# Altium project COMM_BOARD_V1.PrjPcb (part 2 of 2)

## Sheet I2C.SchDoc
size 420 x 297 mm; SheetNumber: 2; SheetTotal: 2
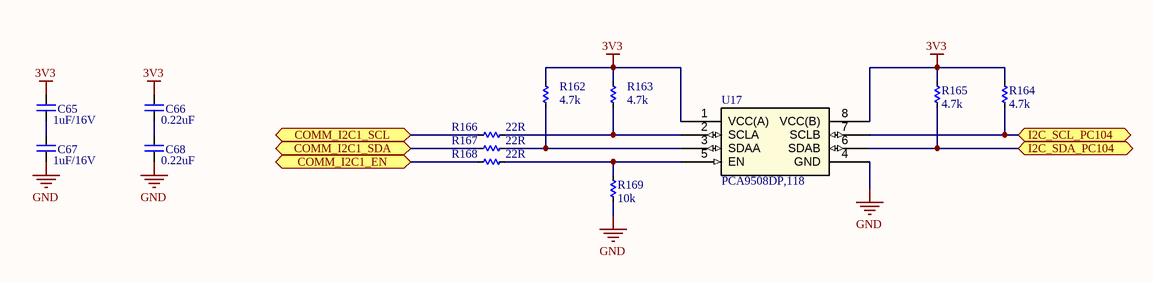
[diagram p12: I2C.SchDoc]

### Parts
C65  1uF/16V  [CAP_C_1608X80]
C66  0.22uF  [CAP_C_1608X80]
C67  1uF/16V  [CAP_C_1608X80]
C68  0.22uF  [CAP_C_1608X80]
R162  4.7k  [RES_C_1608X60]
R163  4.7k  [RES_C_1608X60]
R164  4.7k  [RES_C_1608X60]
R165  4.7k  [RES_C_1608X60]
R166  22R  [RES_C_1608X60]
R167  22R  [RES_C_1608X60]
R168  22R  [RES_C_1608X60]
R169  10k  [RES_C_1608X60]
U17  PCA9508DP,118  [TSSOP8_SOT505-1_NXP]

### Ports
COMM_I2C1_EN (bidir), COMM_I2C1_SCL (bidir), COMM_I2C1_SDA (bidir), I2C_SCL_PC104 (bidir), I2C_SDA_PC104 (bidir)

### Nets
3V3: C65.2 C66.2 R162.1 R163.1 R164.1 R165.1 U17.1(VCC(A)) U17.8(VCC(B))
GND: C67.1 C68.1 R169.2 U17.4(GND)
COMM_I2C4_EN: R168.2 ; port COMM_I2C1_EN
COMM_I2C4_SCL: R166.2 ; port COMM_I2C1_SCL
COMM_I2C4_SDA: R167.2 ; port COMM_I2C1_SDA
NetC65_1: C65.1 C67.2
NetC66_1: C66.1 C68.2
NetJ9_5: R164.2 U17.7(SCLB) ; port I2C_SCL_PC104
NetJ9_6: R165.2 U17.6(SDAB) ; port I2C_SDA_PC104
NetR162_2: R162.2 R167.1 U17.3(SDAA)
NetR163_2: R163.2 R166.1 U17.2(SCLA)
NetR168_1: R168.1 R169.1 U17.5(EN)

### Notes on the sheet
- Sub-system:
- Design by:
- Sheet title:
- Project:
- Sheet:
- of
- Checked by:
- Approved by:
- Doc no:
- Revision:
- Size:
- Date:

### Library data of the parts
C65-C68 = CAP_SMD: CAP_Chip; Value: 33pF
R162-R169 = _RES_B_2: RES
U17 = PCA9508DP,118: No Description Available; Manufacturer_Name: NXP; Copyright: Copyright (C) 2025 Ultra Librarian. All rights reserved.; Manufacturer_Part_Number: PCA9508DP,118; RefDes: RefDes; Type: Type

## Sheet CONNECTOR.SchDoc
size 420 x 297 mm; SheetNumber: 5; SheetTotal: 5
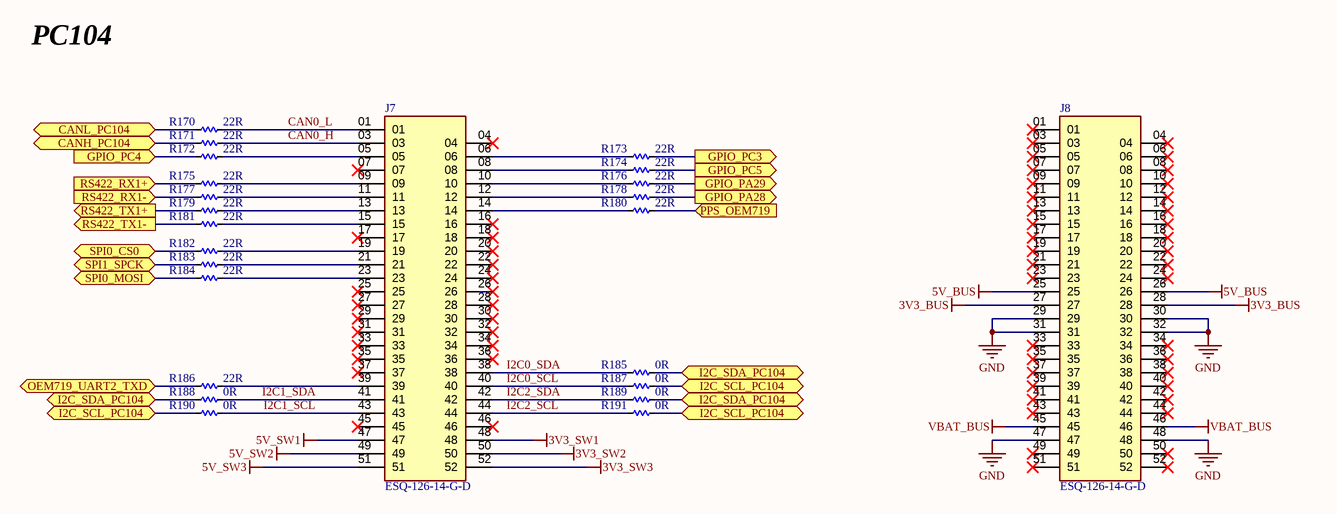
[diagram p13: CONNECTOR.SchDoc]

### Parts
J7  ESQ-126-14-G-D  [ESQ-126-14-G-D]
J8  ESQ-126-14-G-D  [ESQ-126-14-G-D]
R170  22R  [RES_C_1608X60]
R171  22R  [RES_C_1608X60]
R172  22R  [RES_C_1608X60]
R173  22R  [RES_C_1608X60]
R174  22R  [RES_C_1608X60]
R175  22R  [RES_C_1608X60]
R176  22R  [RES_C_1608X60]
R177  22R  [RES_C_1608X60]
R178  22R  [RES_C_1608X60]
R179  22R  [RES_C_1608X60]
R180  22R  [RES_C_1608X60]
R181  22R  [RES_C_1608X60]
R182  22R  [RES_C_1608X60]
R183  22R  [RES_C_1608X60]
R184  22R  [RES_C_1608X60]
R185  0R  [RES_C_1608X60]
R186  22R  [RES_C_1608X60]
R187  0R  [RES_C_1608X60]
R188  0R  [RES_C_1608X60]
R189  0R  [RES_C_1608X60]
R190  0R  [RES_C_1608X60]
R191  0R  [RES_C_1608X60]

### Ports
CANH_PC104 (bidir), CANL_PC104 (bidir), GPIO_PA28 (out), GPIO_PA29 (out), GPIO_PC3 (out), GPIO_PC4 (in), GPIO_PC5 (out), I2C_SCL_PC104 (bidir), I2C_SDA_PC104 (bidir), OEM719_UART2_TXD (bidir), PPS_OEM719 (in), RS422_RX1+ (in), RS422_RX1- (in), RS422_TX1+ (out), RS422_TX1- (out), SPI0_CS0 (bidir), SPI0_MOSI (bidir), SPI1_SPCK (bidir)

### Nets
3V3_BUS: J8.27 J8.28
3V3_SW1: J7.48
3V3_SW2: J7.50
3V3_SW3: J7.52
5V_BUS: J8.25 J8.26
5V_SW1: J7.47
5V_SW2: J7.49
5V_SW3: J7.51
GND: J8.29 J8.30 J8.31 J8.32 J8.47 J8.48
VBAT_BUS: J8.45 J8.46
CAN0_H: J7.03 R171.2
CAN0_L: J7.01 R170.2
I2C0_SCL: J7.40 R187.1
I2C0_SDA: J7.38 R185.1
I2C1_SCL: J7.43 R190.2
I2C1_SDA: J7.41 R188.2
I2C2_SCL: J7.44 R191.1
I2C2_SDA: J7.42 R189.1
NetCR1_1: R171.1 ; port CANH_PC104
NetCR1_2: R170.1 ; port CANL_PC104
NetJ7_05: J7.05 R172.2
NetJ7_06: J7.06 R173.1
NetJ7_08: J7.08 R174.1
NetJ7_09: J7.09 R175.2
NetJ7_10: J7.10 R176.1
NetJ7_11: J7.11 R177.2
NetJ7_12: J7.12 R178.1
NetJ7_13: J7.13 R179.2
NetJ7_14: J7.14 R180.1
NetJ7_15: J7.15 R181.2
NetJ7_19: J7.19 R182.2
NetJ7_21: J7.21 R183.2
NetJ7_23: J7.23 R184.2
NetJ7_39: J7.39 R186.2
NetJ9_5: R187.2 R190.1 R191.2 ; port I2C_SCL_PC104
NetJ9_6: R185.2 R188.1 R189.2 ; port I2C_SDA_PC104
NetR172_1: R172.1 ; port GPIO_PC4
NetR173_2: R173.2 ; port GPIO_PC3
NetR174_2: R174.2 ; port GPIO_PC5
NetR175_1: R175.1 ; port RS422_RX1+
NetR176_2: R176.2 ; port GPIO_PA29
NetR177_1: R177.1 ; port RS422_RX1-
NetR178_2: R178.2 ; port GPIO_PA28
NetR179_1: R179.1 ; port RS422_TX1+
NetR180_2: R180.2 ; port PPS_OEM719
NetR181_1: R181.1 ; port RS422_TX1-
NetR182_1: R182.1 ; port SPI0_CS0
NetR183_1: R183.1 ; port SPI1_SPCK
NetR184_1: R184.1 ; port SPI0_MOSI
NetR186_1: R186.1 ; port OEM719_UART2_TXD

Not connected (* = marked no-connect by the designer): J7 04* 07* 16* 17* 18* 20* 22* 24* 25* 26* 27* 28* 29* 30* 31* 32* 33* 34* 35* 36* 37* 45* 46*; J8 01* 03* 04* 05* 06* 07* 08* 09* 10* 11* 12* 13* 14* 15* 16* 17* 18* 19* 20* 21* 22* 23* 24* 33* 34* 35* 36* 37* 38* 39* 40* 41* 42* 43* 44* 49* 50* 51* 52*

### Notes on the sheet
- PC104
- Sub-system:
- Design by:
- Sheet title:
- Project:
- Sheet:
- of
- Checked by:
- Approved by:
- Doc no:
- Revision:
- Size:
- Date:

### Library data of the parts
J7 J8 = ESQ-126-14-G-D: PC / 104 Connectors Elevated Socket Strip
R170-R191 = _RES_B_2: RES

## Sheet FRAM.SchDoc
size 420 x 297 mm
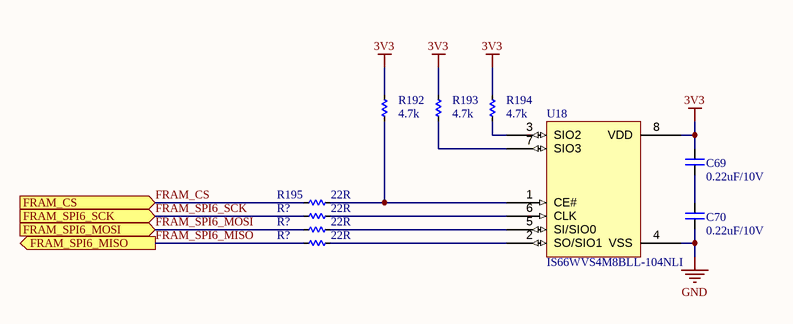
[diagram p14: FRAM.SchDoc]

### Parts
(Parts that share a designator on the sheet are numbered #1, #2 ... from top to bottom, then left to right.)
C69  0.22uF/10V  [CAP_C_1608X80]
C70  0.22uF/10V  [CAP_C_1608X80]
R192  4.7k  [RES_C_1608X60]
R193  4.7k  [RES_C_1608X60]
R194  4.7k  [RES_C_1608X60]
R195  22R  [RES_C_1608X60]
R?#77  22R  [RES_C_1608X60]
R?#78  22R  [RES_C_1608X60]
R?#79  22R  [RES_C_1608X60]
U18  IS66WVS4M8BLL-104NLI  [SOIC8_150MIL_N_ISI]

### Ports
FRAM_CS (in), FRAM_SPI6_MISO (out), FRAM_SPI6_MOSI (in), FRAM_SPI6_SCK (in)

### Nets
3V3: C69.2 R192.2 R193.2 R194.2 U18.8(VDD)
GND: C70.1 U18.4(VSS)
FRAM_CS: R195.1 ; port FRAM_CS
FRAM_SPI6_MISO: R?#79.1 ; port FRAM_SPI6_MISO
FRAM_SPI6_MOSI: R?#78.1 ; port FRAM_SPI6_MOSI
FRAM_SPI6_SCK: R?#77.1 ; port FRAM_SPI6_SCK
NetC69_1: C69.1 C70.2
NetR192_1: R192.1 R195.2 U18.1(CE#)
NetR193_1: R193.1 U18.7(SIO3)
NetR194_1: R194.1 U18.3(SIO2)
NetR?#77_2: R?#77.2 U18.6(CLK)
NetR?#78_2: R?#78.2 U18.5(SI/SIO0)
NetR?#79_2: R?#79.2 U18.2(SO/SIO1)

### Notes on the sheet
- Sub-system:
- Design by:
- Sheet title:
- Project:
- Sheet:
- of
- Checked by:
- Approved by:
- Doc no:
- Revision:
- Size:
- Date:

### Library data of the parts
C69 C70 = CAP_SMD: CAP_Chip; Value: 33pF
R192-R195 R?#77-R?#79 = _RES_B_2: RES
U18 = IS66WVS4M8BLL-104NLI: No Description Available; Manufacturer_Name: ISSI; Type: Memory; Copyright: Copyright (C) 2025 Ultra Librarian. All rights reserved.; Manufacturer_Part_Number: IS66WVS4M8BLL-104NLI; RefDes: RefDes

## Sheet CONNECT_EXP.SchDoc
size 420 x 297 mm
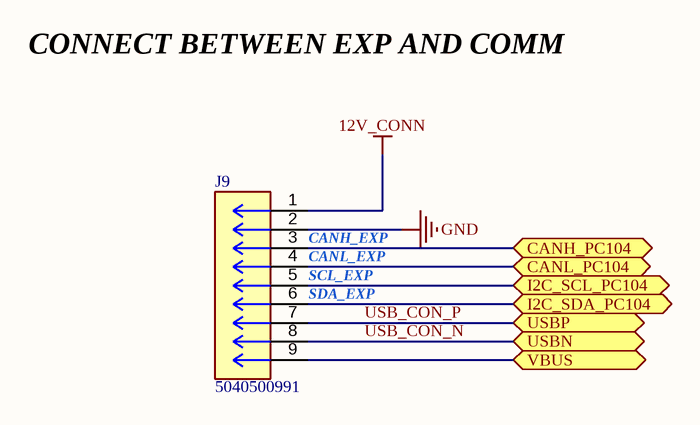
[diagram p15: CONNECT_EXP.SchDoc]

### Parts
J9  5040500991  [5040500991]

### Ports
CANH_PC104 (bidir), CANL_PC104 (bidir), I2C_SCL_PC104 (bidir), I2C_SDA_PC104 (bidir), USBN (bidir), USBP (bidir), VBUS (bidir)

### Nets
12V_CONN: J9.1
GND: J9.2
USB_CON_N: J9.8 ; port USBN
USB_CON_P: J9.7 ; port USBP
NetCR1_1: J9.3 ; port CANH_PC104
NetCR1_2: J9.4 ; port CANL_PC104
NetJ9_5: J9.5 ; port I2C_SCL_PC104
NetJ9_6: J9.6 ; port I2C_SDA_PC104
NetJ9_9: J9.9 ; port VBUS

### Notes on the sheet
- CONNECT BETWEEN EXP AND COMM
- (near J9) CANL_EXP
- (near J9) CANH_EXP
- (near J9) SCL_EXP
- (near J9) SDA_EXP
- Sub-system:
- Design by:
- Sheet title:
- Project:
- Sheet:
- of
- Checked by:
- Approved by:
- Doc no:
- Revision:
- Size:
- Date:

### Library data of the parts
J9 = 5040500991: Connector Header Surface Mount, Right Angle 9 position 0.059" (1.50mm)

## Sheet WATCHDOG.SchDoc
size 420 x 297 mm; SheetNumber: 4; SheetTotal: 4
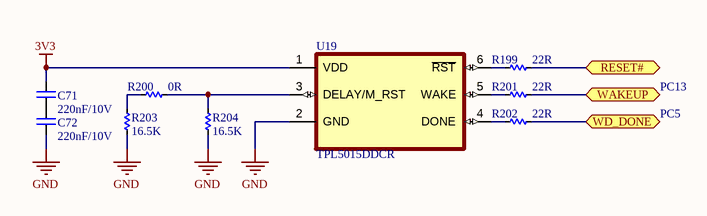
[diagram p16: WATCHDOG.SchDoc]

### Parts
C71  220nF/10V  [CAP_C_1608X80]
C72  220nF/10V  [CAP_C_1608X80]
R199  22R  [RES_C_1608X60]
R200  0R  [RES_C_1608X60]
R201  22R  [RES_C_1608X60]
R202  22R  [RES_C_1608X60]
R203  16.5K  [RES_C_1608X60]
R204  16.5K  [RES_C_1608X60]
U19  TPL5015DDCR  [TPL5010DDCR]

### Ports
RESET# (bidir), WAKEUP (bidir), WD_DONE (bidir)

### Nets
3V3: C71.2 U19.1(VDD)
GND: C72.1 R203.1 R204.1 U19.2(GND)
RESET#: R199.2 ; port RESET#
WAKEUP: R201.2 ; port WAKEUP
WD_DONE: R202.2 ; port WD_DONE
NetC71_1: C71.1 C72.2
NetR199_1: R199.1 U19.6(~{RST})
NetR200_1: R200.1 R203.2
NetR200_2: R200.2 R204.2 U19.3(DELAY/M_RST)
NetR201_1: R201.1 U19.5(WAKE)
NetR202_1: R202.1 U19.4(DONE)

### Notes on the sheet
- PC13
- PC5
- Sub-system:
- Design by:
- Sheet title:
- Project:
- Sheet:
- of
- Checked by:
- Approved by:
- Doc no:
- Revision:
- Size:
- Date:

### Library data of the parts
C71 C72 = CAP_SMD: CAP_Chip; Value: 33pF
R199-R204 = _RES_B_2: RES
U19 = TPL5015DDCR: OSC PROG TIMER TSOT23-6

## Nets that join several sheets
1V8: POWER (C61.2 U?#3.2), USB_HS_DEVICE (C33.2 U8.28 U8.30)
3V3: POWER (9 pins), MCU (5 pins), SDRAM (28 pins), MCU_POWER (6 pins), eMMC (26 pins), USB_HS_DEVICE (11 pins), LVDS (6 pins), DEBUG (J5.6 J6.1), I2C (8 pins), FRAM (5 pins), WATCHDOG (C71.2 U19.1)
12V_CONN: POWER (6 pins), CONNECT_EXP (J9.1)
GND: POWER (30 pins), MCU (11 pins), SDRAM (28 pins), MCU_POWER (78 pins), eMMC (18 pins), CAN (6 pins), USB_HS_DEVICE (18 pins), LVDS (7 pins), MODULE_FPGA (J3.5), DEBUG (J5.10 J6.9), I2C (C67.1 C68.1 R169.2 U17.4), CONNECTOR (6 pins), FRAM (C70.1 U18.4), CONNECT_EXP (J9.2), WATCHDOG (C72.1 R203.1 R204.1 U19.2)
CAN_RX: MCU (U5.E16), CAN (U9.4)
CAN_TX: MCU (U5.E17), CAN (U9.1)
COMM_I2C4_SCL: MCU (U5.B5 U5.R16), I2C (R166.2)
COMM_I2C4_SDA: MCU (U5.C5 U5.R17), I2C (R167.2)
DEBUG_UART_RX: MCU (U5.N4), DEBUG (J5.9 R161.1)
DEBUG_UART_TX: MCU (U5.N5), DEBUG (J5.8 R160.1)
FPGA_RefC: MCU (U5.E15), MODULE_FPGA (U12.18)
FPGA_TxC: MCU (U5.N3), MODULE_FPGA (U12.17)
JTCK/SWCLK: MCU (U5.B14), DEBUG (J5.2 R158.2)
JTDI: MCU (U5.A14), DEBUG (J5.4 J6.8)
JTDO/SWO: MCU (U5.C6), DEBUG (J5.1 R157.2)
JTMS/SWDIO: MCU (U5.C15), DEBUG (J5.3 R159.2)
K_IN: MCU (U5.B10), MODULE_FPGA (U12.16)
LVDS_SPI_MOSI: MCU (U5.C11), LVDS (U10.5)
LVDS_SPI_SCK: MCU (U5.B9), LVDS (U11.5)
NetCR1_1: CAN (CR1.1 R143.2 U9.7), CONNECTOR (R171.1), CONNECT_EXP (J9.3)
NetCR1_2: CAN (CR1.2 R144.1 U9.6), CONNECTOR (R170.1), CONNECT_EXP (J9.4)
NetJ9_5: I2C (R164.2 U17.7), CONNECTOR (R187.2 R190.1 R191.2), CONNECT_EXP (J9.5)
NetJ9_6: I2C (R165.2 U17.6), CONNECTOR (R185.2 R188.1 R189.2), CONNECT_EXP (J9.6)
NetJ9_9: USB_HS_DEVICE (R117.2), CONNECT_EXP (J9.9)
NetR107_1: POWER (R152.1 U?#1.9), MCU (R107.1)
RESET#: MCU (BT?.2 C28.2 R?#4.1 R?#9.2), eMMC (R19.2), USB_HS_DEVICE (R136.2 U8.27), DEBUG (J5.7 J6.3), WATCHDOG (R199.2)
SDIO1_CK: MCU (U5.C12), eMMC (R20.1)
SDIO1_CMD: MCU (U5.D12), eMMC (R18.1 R21.1)
SDIO1_D0: MCU (U5.E13), eMMC (R1.1 R9.1)
SDIO1_D1: MCU (U5.E14), eMMC (R2.1 R10.1)
SDIO1_D2: MCU (U5.A13), eMMC (R3.1 R11.1)
SDIO1_D3: MCU (U5.B13), eMMC (R4.1 R12.1)
SDIO1_D4: MCU (U5.D5), eMMC (R5.1 R13.1)
SDIO1_D5: MCU (U5.D4), eMMC (R6.1 R14.1)
SDIO1_D6: MCU (U5.F14), eMMC (R7.1 R15.1)
SDIO1_D7: MCU (U5.F13), eMMC (R8.1 R16.1)
SDRAM_A0: MCU (U5.G4), SDRAM (R?#32.1)
SDRAM_A1: MCU (U5.G3), SDRAM (R?#30.1)
SDRAM_A2: MCU (U5.G1), SDRAM (R?#28.1)
SDRAM_A3: MCU (U5.H4), SDRAM (R?#26.1)
SDRAM_A4: MCU (U5.J5), SDRAM (R?#24.1)
SDRAM_A5: MCU (U5.J4), SDRAM (R?#22.1)
SDRAM_A6: MCU (U5.R7), SDRAM (R?#20.1)
SDRAM_A7: MCU (U5.P7), SDRAM (R?#18.1)
SDRAM_A8: MCU (U5.P8), SDRAM (R?#16.1)
SDRAM_A9: MCU (U5.R9), SDRAM (R?#14.1)
SDRAM_A10: MCU (U5.T8), SDRAM (R?#12.1)
SDRAM_A11: MCU (U5.U8), SDRAM (R?#10.1)
SDRAM_BA0: MCU (U5.H14), SDRAM (R?#37.1)
SDRAM_BA1: MCU (U5.G14), SDRAM (R?#35.1)
SDRAM_D0: MCU (U5.P16), SDRAM (R?#65.2)
SDRAM_D1: MCU (U5.P15), SDRAM (R?#64.2)
SDRAM_D2: MCU (U5.D13), SDRAM (R?#63.2)
SDRAM_D3: MCU (U5.E12), SDRAM (R?#62.2)
SDRAM_D4: MCU (U5.U9), SDRAM (R?#61.2)
SDRAM_D5: MCU (U5.T9), SDRAM (R?#60.2)
SDRAM_D6: MCU (U5.P9), SDRAM (R?#59.2)
SDRAM_D7: MCU (U5.N9), SDRAM (R?#57.2)
SDRAM_D8: MCU (U5.P10), SDRAM (R?#55.2)
SDRAM_D9: MCU (U5.R10), SDRAM (R?#53.2)
SDRAM_D10: MCU (U5.T10), SDRAM (R?#51.2)
SDRAM_D11: MCU (U5.U10), SDRAM (R?#50.2)
SDRAM_D12: MCU (U5.R11), SDRAM (R?#48.2)
SDRAM_D13: MCU (U5.U16), SDRAM (R?#46.2)
SDRAM_D14: MCU (U5.T17), SDRAM (R?#44.2)
SDRAM_D15: MCU (U5.T16), SDRAM (R?#42.2)
SDRAM_D16: MCU (U5.T13), SDRAM (R?#39.2)
SDRAM_D17: MCU (U5.R13), SDRAM (R?#38.2)
SDRAM_D18: MCU (U5.P13), SDRAM (R?#36.2)
SDRAM_D19: MCU (U5.P14), SDRAM (R?#34.2)
SDRAM_D20: MCU (U5.R14), SDRAM (R?#33.2)
SDRAM_D21: MCU (U5.D16), SDRAM (R?#31.2)
SDRAM_D22: MCU (U5.B17), SDRAM (R?#29.2)
SDRAM_D23: MCU (U5.B16), SDRAM (R?#27.2)
SDRAM_D24: MCU (U5.A16), SDRAM (R?#25.2)
SDRAM_D25: MCU (U5.A15), SDRAM (R?#23.2)
SDRAM_D26: MCU (U5.B15), SDRAM (R?#21.2)
SDRAM_D27: MCU (U5.C14), SDRAM (R?#19.2)
SDRAM_D28: MCU (U5.A2), SDRAM (R?#17.2)
SDRAM_D29: MCU (U5.B3), SDRAM (R?#15.2)
SDRAM_D30: MCU (U5.E2), SDRAM (R?#13.2)
SDRAM_D31: MCU (U5.F3), SDRAM (R?#11.2)
SDRAM_NBL0: MCU (U5.C4), SDRAM (R?#58.1)
SDRAM_NBL1: MCU (U5.B4), SDRAM (R?#56.1)
SDRAM_NBL2: MCU (U5.A4), SDRAM (R?#54.1)
SDRAM_NBL3: MCU (U5.A3), SDRAM (R?#52.1)
SDRAM_SDCKE1: MCU (U5.U13), SDRAM (R?#47.1)
SDRAM_SDCLK: MCU (U5.F15), SDRAM (R?#49.1)
SDRAM_SDNCAS: MCU (U5.D6), SDRAM (R?#41.1)
SDRAM_SDNE1: MCU (U5.T11), SDRAM (R?#45.1)
SDRAM_SDNWE: MCU (U5.P4), SDRAM (R?#40.1)
ULPI_CK: MCU (U5.T3), USB_HS_DEVICE (R?#68.2)
ULPI_D0: MCU (U5.U2), USB_HS_DEVICE (R?#76.2)
ULPI_D1: MCU (U5.U5), USB_HS_DEVICE (R?#75.2)
ULPI_D2: MCU (U5.T5), USB_HS_DEVICE (R?#74.2)
ULPI_D3: MCU (U5.P11), USB_HS_DEVICE (R?#73.2)
ULPI_D4: MCU (U5.P12), USB_HS_DEVICE (R?#72.2)
ULPI_D5: MCU (U5.T14), USB_HS_DEVICE (R?#71.2)
ULPI_D6: MCU (U5.U14), USB_HS_DEVICE (R?#70.2)
ULPI_D7: MCU (U5.A5), USB_HS_DEVICE (R?#69.2)
ULPI_DIR: MCU (U5.F4), USB_HS_DEVICE (R?#66.2)
ULPI_NXT: MCU (U5.M4), USB_HS_DEVICE (R120.2)
ULPI_STP: MCU (U5.L2), USB_HS_DEVICE (R?#67.2)
USB_CON_N: USB_HS_DEVICE (R119.2), CONNECT_EXP (J9.8)
USB_CON_P: USB_HS_DEVICE (R118.2), CONNECT_EXP (J9.7)
WAKEUP: MCU (U5.E3), WATCHDOG (R201.2)